# Altium schematic sheet PCB_m5 Sheet.SchDoc
size A; SheetNumber: 1; SheetTotal: 1
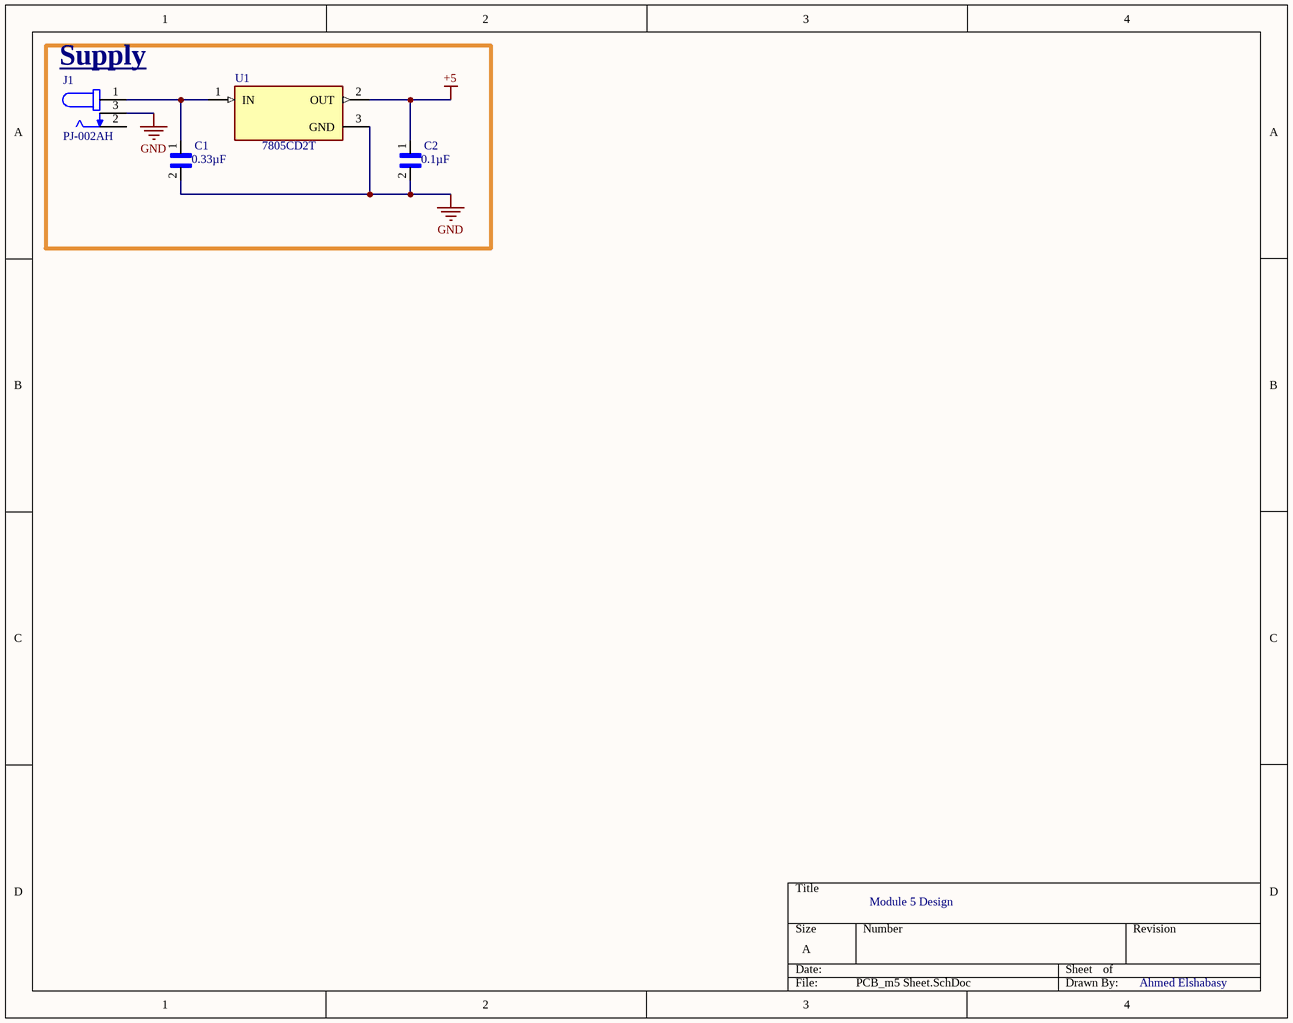
[diagram p0: PCB_m5 Sheet.SchDoc]

## Parts
C1  0.33µF  [CAPC3216X190N]
C2  0.1µF  [CAPC3216X190N]
J1  PJ-002AH  [CUI_PJ-002AH]
U1  7805CD2T  [TO254P1542X460-3N]

## Blocks framed on the sheet
Supply: C1 C2 J1 U1

## Nets
+5: C2.1 U1.2(OUT)
GND: C1.2 C2.2 J1.3 U1.3(GND)
NetC1_1: C1.1 J1.1 U1.1(IN)

Not connected (* = marked no-connect by the designer): J1 2

## Notes on the sheet
- Module 5 Design
- Ahmed Elshabasy

## Library data of the parts
C1 C2 = GRM31CR60J227ME11L: SMD Multilayer Ceramic Capacitor, GRM Series, 220 F, 20%, X5R, 6.3 V, 1206 [3216 Metric]; MF: Murata Electronics; Digi-Key_Part_Number: 490-13970-1-ND; Package: 3216 Murata; MP: GRM31CR60J227ME11L; SnapEDA_Link: https://www.snapeda.com/parts/GRM31CR60J227ME11L/Murata%20Electronics%20North%20America/view-part/1756709/?ref=snap; Purchase-URL: https://pricing.snapeda.com/search/part/GRM31CR60J227ME11L/?ref=eda; Check_prices: https://www.snapeda.com/parts/GRM31CR60J227ME11L/Murata%20Electronics%20North%20America/view-part/1756709/?ref=eda; Value: *
J1 = PJ-002AH: 2.0 x 6.5 mm, 5.0 A, Horizontal, Through Hole, Dc Power Jack Connector; MF: CUI Devices; Purchase-URL: https://pricing.snapeda.com/search/part/PJ-002AH/?ref=eda; Check_prices: https://www.snapeda.com/parts/PJ-002AH/CUI+Devices/view-part/?ref=eda; Value: *; Package: None; Price: None; Availability: In Stock; MP: PJ-002AH; CUI_purchase_URL: https://www.cuidevices.com/product/interconnect/connectors/dc-power-connectors/jacks/pj-002ah?utm_source=snapeda.com&utm_medium=referral&utm_campaign=snapedaBOM; SnapEDA_Link: https://www.snapeda.com/parts/PJ-002AH/CUI+Devices/view-part/?ref=snap
U1 = 7805CD2T: Linear Voltage Regulator IC Positive Fixed 1 Output 1.5A D2PAK; MF: STMicroelectronics; SnapEDA_Link: https://www.snapeda.com/parts/7805CD2T/STMicroelectronics/view-part/?ref=snap; Package: D2PAK STMicroelectronics; Value: *; MP: 7805CD2T; Check_prices: https://www.snapeda.com/parts/7805CD2T/STMicroelectronics/view-part/?ref=eda